# Altium schematic sheet Sheet1.SchDoc
size A
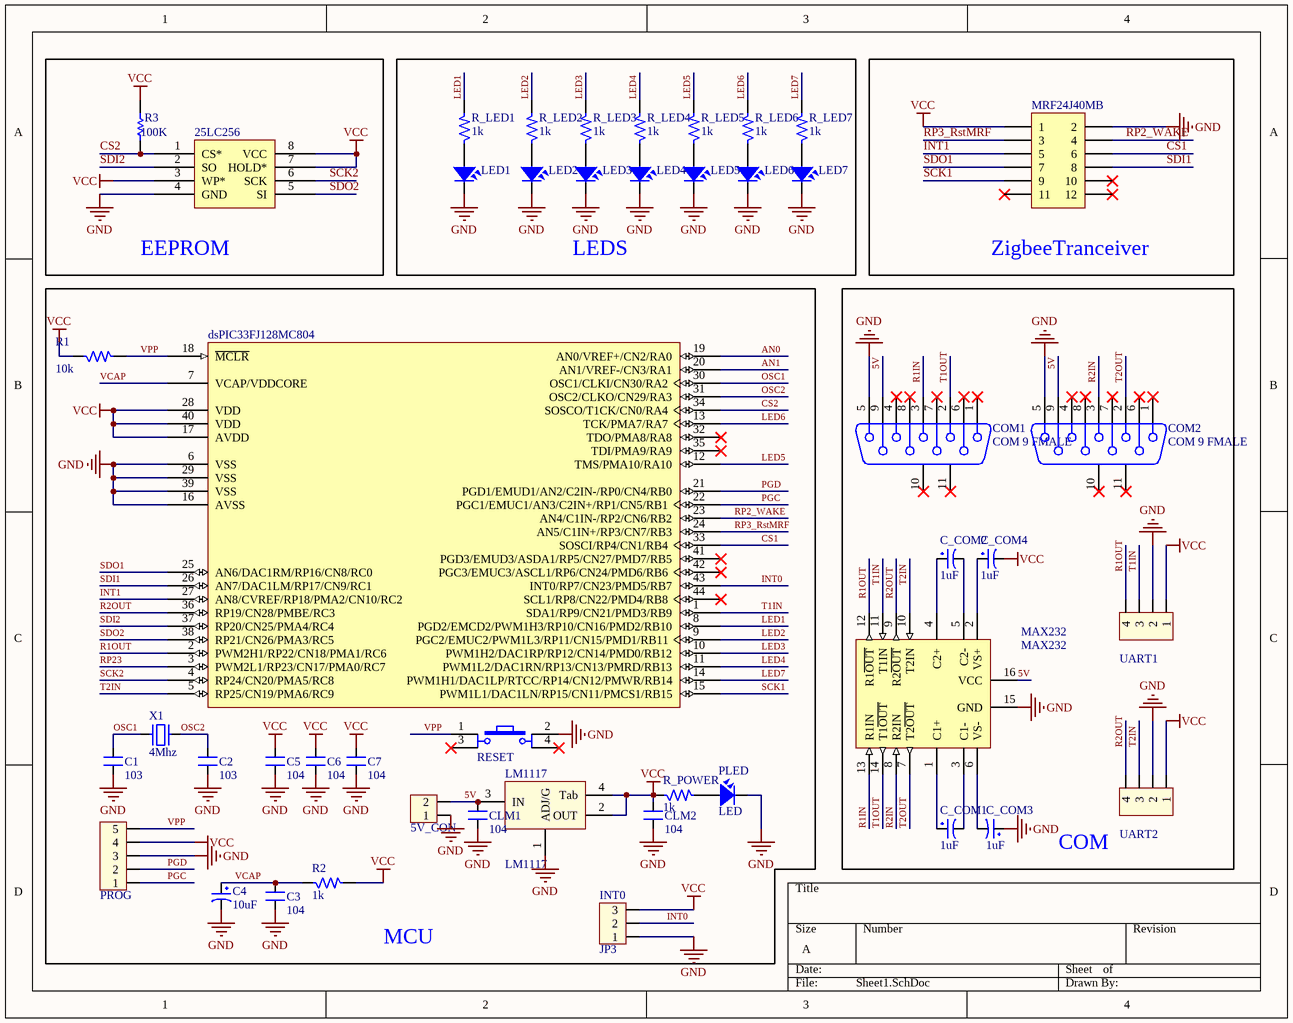
[diagram p0: Sheet1.SchDoc]

## Parts
5V_CON  JP2  [CON2]  (value not drawn)
25LC256  25LC256  [DIP-8]  (value not drawn)
C1  103  [SM-0805]
C2  103  [SM-0805]
C3  104  [SM-0805]
C4  10uF  [CP1/2]
C5  104  [SM-0805]
C6  104  [SM-0805]
C7  104  [SM-0805]
C_COM1  1uF  [CP1/2]
C_COM2  1uF  [CP1/2]
C_COM3  1uF  [CP1/2]
C_COM4  1uF  [CP1/2]
CLM1  104  [SM-0805]
CLM2  104  [SM-0805]
COM1  COM 9 FMALE  [DSB 9-F]
COM2  COM 9 FMALE  [DSB 9-F]
dsPIC33FJ128MC804  DSPIC33FJ128MC804T-E/PT  [TQFP-PT44_N]  (value not drawn)
INT0  JP3  [CON3]
LED1  LED  [SM-LED-Red]  (value not drawn)
LED2  LED  [SM-LED-Red]  (value not drawn)
LED3  LED  [SM-LED-Red]  (value not drawn)
LED4  LED  [SM-LED-Red]  (value not drawn)
LED5  LED  [SM-LED-Red]  (value not drawn)
LED6  LED  [SM-LED-Red]  (value not drawn)
LED7  LED  [SM-LED-Red]  (value not drawn)
LM1117  LM1117  [SOT223-4N]
MAX232  MAX232  [SOP16]
MRF24J40MB  Header 6X2  [MRF24J40MB_board_mini]  (value not drawn)
PLED  LED  [LED-3]
PROG  JP5  [CON5]  (value not drawn)
R1  10k  [C0805]
R2  1k  [SM-0805]
R3  value 100K  [C0805]  (hidden comment: Res Semi)
R_LED1  1k  [SM-0805]
R_LED2  1k  [SM-0805]
R_LED3  1k  [SM-0805]
R_LED4  1k  [SM-0805]
R_LED5  1k  [SM-0805]
R_LED6  1k  [SM-0805]
R_LED7  1k  [SM-0805]
R_POWER  1k  [SM-0805]
RESET  SW  [SW4]  (value not drawn)
UART1  JP4  [CON4]  (value not drawn)
UART2  JP4  [CON4]  (value not drawn)
X1  4Mhz  [XT2]

## Blocks framed on the sheet
EEPROM: 25LC256 R3
LEDS: LED1-LED7 R_LED1-R_LED7
ZigbeeTranceiver: MRF24J40MB
MCU: 5V_CON C1-C7 CLM1 CLM2 dsPIC33FJ128MC804 INT0 LM1117 PLED PROG R1 R2 R_POWER RESET X1
COM: C_COM1-C_COM4 COM1 COM2 MAX232 UART1 UART2

## Nets
GND: 5V_CON.1 25LC256.4(GND) C1.1 C2.1 C3.1 C4.2 C5.1 C6.1 C7.1 C_COM3.1 CLM1.1 CLM2.1 COM1.5 COM2.5 dsPIC33FJ128MC804.6(VSS) dsPIC33FJ128MC804.16(AVSS) dsPIC33FJ128MC804.29(VSS) dsPIC33FJ128MC804.39(VSS) INT0.1 LED1.2 LED2.2 LED3.2 LED4.2 LED5.2 LED6.2 LED7.2 LM1117.1(ADJ/G) MAX232.15(GND) MRF24J40MB.2 PLED.2 PROG.3 RESET.2 UART1.2 UART2.2
VCC: 25LC256.3(WP*) 25LC256.7(HOLD*) 25LC256.8(VCC) C5.2 C6.2 C7.2 C_COM4.2 CLM2.2 dsPIC33FJ128MC804.17(AVDD) dsPIC33FJ128MC804.28(VDD) dsPIC33FJ128MC804.40(VDD) INT0.3 LM1117.2(OUT) LM1117.4(Tab) MRF24J40MB.1 PROG.4 R1.1 R2.2 R3.2 R_POWER.1 UART1.1 UART2.1
5V: 5V_CON.2 CLM1.2 COM1.9 COM2.9 LM1117.3(IN) MAX232.16(VCC)
AN0: dsPIC33FJ128MC804.19(AN0/VREF+/CN2/RA0)
AN1: dsPIC33FJ128MC804.20(AN1/VREF-/CN3/RA1)
CS1: dsPIC33FJ128MC804.33(SOSCI/RP4/CN1/RB4) MRF24J40MB.6
CS2: 25LC256.1(CS*) dsPIC33FJ128MC804.34(SOSCO/T1CK/CN0/RA4) R3.1
INT0: dsPIC33FJ128MC804.43(INT0/RP7/CN23/PMD5/RB7) INT0.2
INT1: dsPIC33FJ128MC804.27(AN8/CVREF/RP18/PMA2/CN10/RC2) MRF24J40MB.5
LED1: dsPIC33FJ128MC804.8(PGD2/EMCD2/PWM1H3/RP10/CN16/PMD2/RB10) R_LED1.2
LED2: dsPIC33FJ128MC804.9(PGC2/EMUC2/PWM1L3/RP11/CN15/PMD1/RB11) R_LED2.2
LED3: dsPIC33FJ128MC804.10(PWM1H2/DAC1RP/RP12/CN14/PMD0/RB12) R_LED3.2
LED4: dsPIC33FJ128MC804.11(PWM1L2/DAC1RN/RP13/CN13/PMRD/RB13) R_LED4.2
LED5: dsPIC33FJ128MC804.12(TMS/PMA10/RA10) R_LED5.2
LED6: dsPIC33FJ128MC804.13(TCK/PMA7/RA7) R_LED6.2
LED7: dsPIC33FJ128MC804.14(PWM1H1/DAC1LP/RTCC/RP14/CN12/PMWR/RB14) R_LED7.2
OSC1: C1.2 dsPIC33FJ128MC804.30(OSC1/CLKI/CN30/RA2) X1.1
OSC2: C2.2 dsPIC33FJ128MC804.31(OSC2/CLKO/CN29/RA3) X1.2
PGC: dsPIC33FJ128MC804.22(PGC1/EMUC1/AN3/C2IN+/RP1/CN5/RB1) PROG.1
PGD: dsPIC33FJ128MC804.21(PGD1/EMUD1/AN2/C2IN-/RP0/CN4/RB0) PROG.2
R1IN: COM1.3 MAX232.13(R1IN)
R1OUT: dsPIC33FJ128MC804.2(PWM2H1/RP22/CN18/PMA1/RC6) MAX232.12(R1~{OUT}) UART1.4
R2IN: COM2.3 MAX232.8(R2IN)
R2OUT: dsPIC33FJ128MC804.36(RP19/CN28/PMBE/RC3) MAX232.9(R2~{OUT}) UART2.4
RP2_WAKE: dsPIC33FJ128MC804.23(AN4/C1IN-/RP2/CN6/RB2) MRF24J40MB.4
RP3_RstMRF: dsPIC33FJ128MC804.24(AN5/C1IN+/RP3/CN7/RB3) MRF24J40MB.3
RP23: dsPIC33FJ128MC804.3(PWM2L1/RP23/CN17/PMA0/RC7)
SCK1: dsPIC33FJ128MC804.15(PWM1L1/DAC1LN/RP15/CN11/PMCS1/RB15) MRF24J40MB.9
SCK2: 25LC256.6(SCK) dsPIC33FJ128MC804.4(RP24/CN20/PMA5/RC8)
SDI1: dsPIC33FJ128MC804.26(AN7/DAC1LM/RP17/CN9/RC1) MRF24J40MB.8
SDI2: 25LC256.2(SO) dsPIC33FJ128MC804.37(RP20/CN25/PMA4/RC4)
SDO1: dsPIC33FJ128MC804.25(AN6/DAC1RM/RP16/CN8/RC0) MRF24J40MB.7
SDO2: 25LC256.5(SI) dsPIC33FJ128MC804.38(RP21/CN26/PMA3/RC5)
T1IN: dsPIC33FJ128MC804.1(SDA1/RP9/CN21/PMD3/RB9) MAX232.11(T1IN) UART1.3
T1OUT: COM1.2 MAX232.14(T1~{OUT})
T2IN: dsPIC33FJ128MC804.5(RP25/CN19/PMA6/RC9) MAX232.10(T2IN) UART2.3
T2OUT: COM2.2 MAX232.7(T2~{OUT})
VCAP: C3.2 C4.1 dsPIC33FJ128MC804.7(VCAP/VDDCORE) R2.1
VPP: dsPIC33FJ128MC804.18(~{MCLR}) PROG.5 R1.2 RESET.1
NetC_COM1_1: C_COM1.1 MAX232.1(C1+)
NetC_COM1_2: C_COM1.2 MAX232.3(C1-)
NetC_COM2_1: C_COM2.1 MAX232.4(C2+)
NetC_COM2_2: C_COM2.2 MAX232.5(C2-)
NetC_COM3_2: C_COM3.2 MAX232.6(VS-)
NetC_COM4_1: C_COM4.1 MAX232.2(VS+)
NetLED1_1: LED1.1 R_LED1.1
NetLED2_1: LED2.1 R_LED2.1
NetLED3_1: LED3.1 R_LED3.1
NetLED4_1: LED4.1 R_LED4.1
NetLED5_1: LED5.1 R_LED5.1
NetLED6_1: LED6.1 R_LED6.1
NetLED7_1: LED7.1 R_LED7.1
NetPLED_1: PLED.1 R_POWER.2

Not connected (* = marked no-connect by the designer): COM1 1* 4* 6* 7* 8* 10(MH1)* 11(MH2)*; COM2 1* 4* 6* 7* 8* 10(MH1)* 11(MH2)*; dsPIC33FJ128MC804 32(TDO/PMA8/RA8)* 35(TDI/PMA9/RA9)* 41(PGD3/EMUD3/ASDA1/RP5/CN27/PMD7/RB5)* 42(PGC3/EMUC3/ASCL1/RP6/CN24/PMD6/RB6)* 44(SCL1/RP8/CN22/PMD4/RB8)*; MRF24J40MB 10* 11* 12*; RESET 3* 4*

## Library data of the parts
5V_CON = Con2: Connector 2; Value: Connector 2
C1 C2 = CM: Cap SMD; Value: 103
C3 C5-C7 = CM: Cap SMD; Value: 103
C4 C_COM1-C_COM4 = CP1: Cap P  0,1uF < 22uF , 16 - 50V; Value: 10uF/50V; Description 1: 10 => 220uF/6,3V/10V - 10uF => 100uF/16V; Description 2: 0,1uF => 33uF/50V - 10uF => 22uF/63V; Description 3: 0,47uF => 10uF/100V
CLM1 CLM2 = CN2: Cap np 104 => 105pF; Value: 0.1uF; Description: Cap np Cremic Value  104pF => 105pF
COM1 COM2 = DSB9F: COM 9; PackageDocument: O; Positions: 9; Gender: Receptacle; Value: COM 9; Published: 15-Jun-2001; LatestRevisionDate: 17-Jul-2002; LatestRevisionNote: Re-released for DXP Platform.; DatasheetDocument: 1-Sep-1999; PackageReference: 788750; Publisher: Altium Limited; Orientation: Right Angle
dsPIC33FJ128MC804 = DSPIC33FJ128MC804T-E/PT: High-Performance 16-bit Digital Signal Controller, 128 KB Flash, 16 KB RAM, 44-Pin TQFP, Extended High Temperature, Tape and Reel; FirstPublished: 29-Jan-2009; LatestRevisionDate: 02-Dec-2009; LatestRevisionNote: Updated to datasheet revision D, Nov-2009; DatasheetVersion: revD, Nov-2009; PackageVersion: revBB, Aug-2009; PackageReference: TQFP-PT44; Publisher: Altium Limited; PackageDescription: 44-Lead Plastic Thin Quad Flatpack (PT) - 10x10x1mm Body, 2.00mm [TQFP]; Code_JEDEC: MS-026; ComponentLink1Description: Datasheet; ComponentLink1URL: http://ww1.microchip.com/downloads/en/DeviceDoc/70291D.pdf; ComponentLink2Description: Packaging Specification; ComponentLink2URL: http://www.microchip.com/stellent/groups/techpub_sg/documents/packagingspec/en012702.pdf; ComponentLink3Description: Microchip.com Home; ComponentLink3URL: http://www.microchip.com/
INT0 = Con3: Connector 3; Value: Connector 3
LED1-LED7 PLED = LED: LED Single colour Green and Red; Value: LED 3 ly Single Colour; Description: LED 5 ly Single Colour; Description: Led  Vuong
LM1117 = LM1117: 3v3; Value: LM317
MAX232 = MAX232: Dual EIA-232 Driver/Receiver; Value: MAX232
MRF24J40MB = Header 6X2: Header, 6-Pin, Dual row; LatestRevisionDate: 17-Jul-2002; LatestRevisionNote: Re-released for DXP Platform.; Publisher: Altium Limited
PROG = Con5: Connector 5; Value: Connector 5
R1 R2 R_LED1-R_LED7 R_POWER = R: Resistor 1/4W; Value: R1/4W - 1K
R3 = Res Semi: Semiconductor Resistor; Published: 8-Jun-2000; LatestRevisionDate: 17-Jul-2002; LatestRevisionNote: Re-released for DXP Platform.; PackageReference: AXIAL-0.5; Publisher: Altium Limited; PackageDescription: Axial Device, Thru-Hole; 2 Leads; 0.5 in Pin Spacing
RESET = SW4: Switch button 4 pin; Value: Button chip 4 pin
UART1 UART2 = Con4: Connector 4; Value: Connector 4
X1 = XT2: Crystal For all Crystal 2pin.; Value: 4Mhz